# EAGLE schematic obd25k80 (EAGLE 9.6.2)
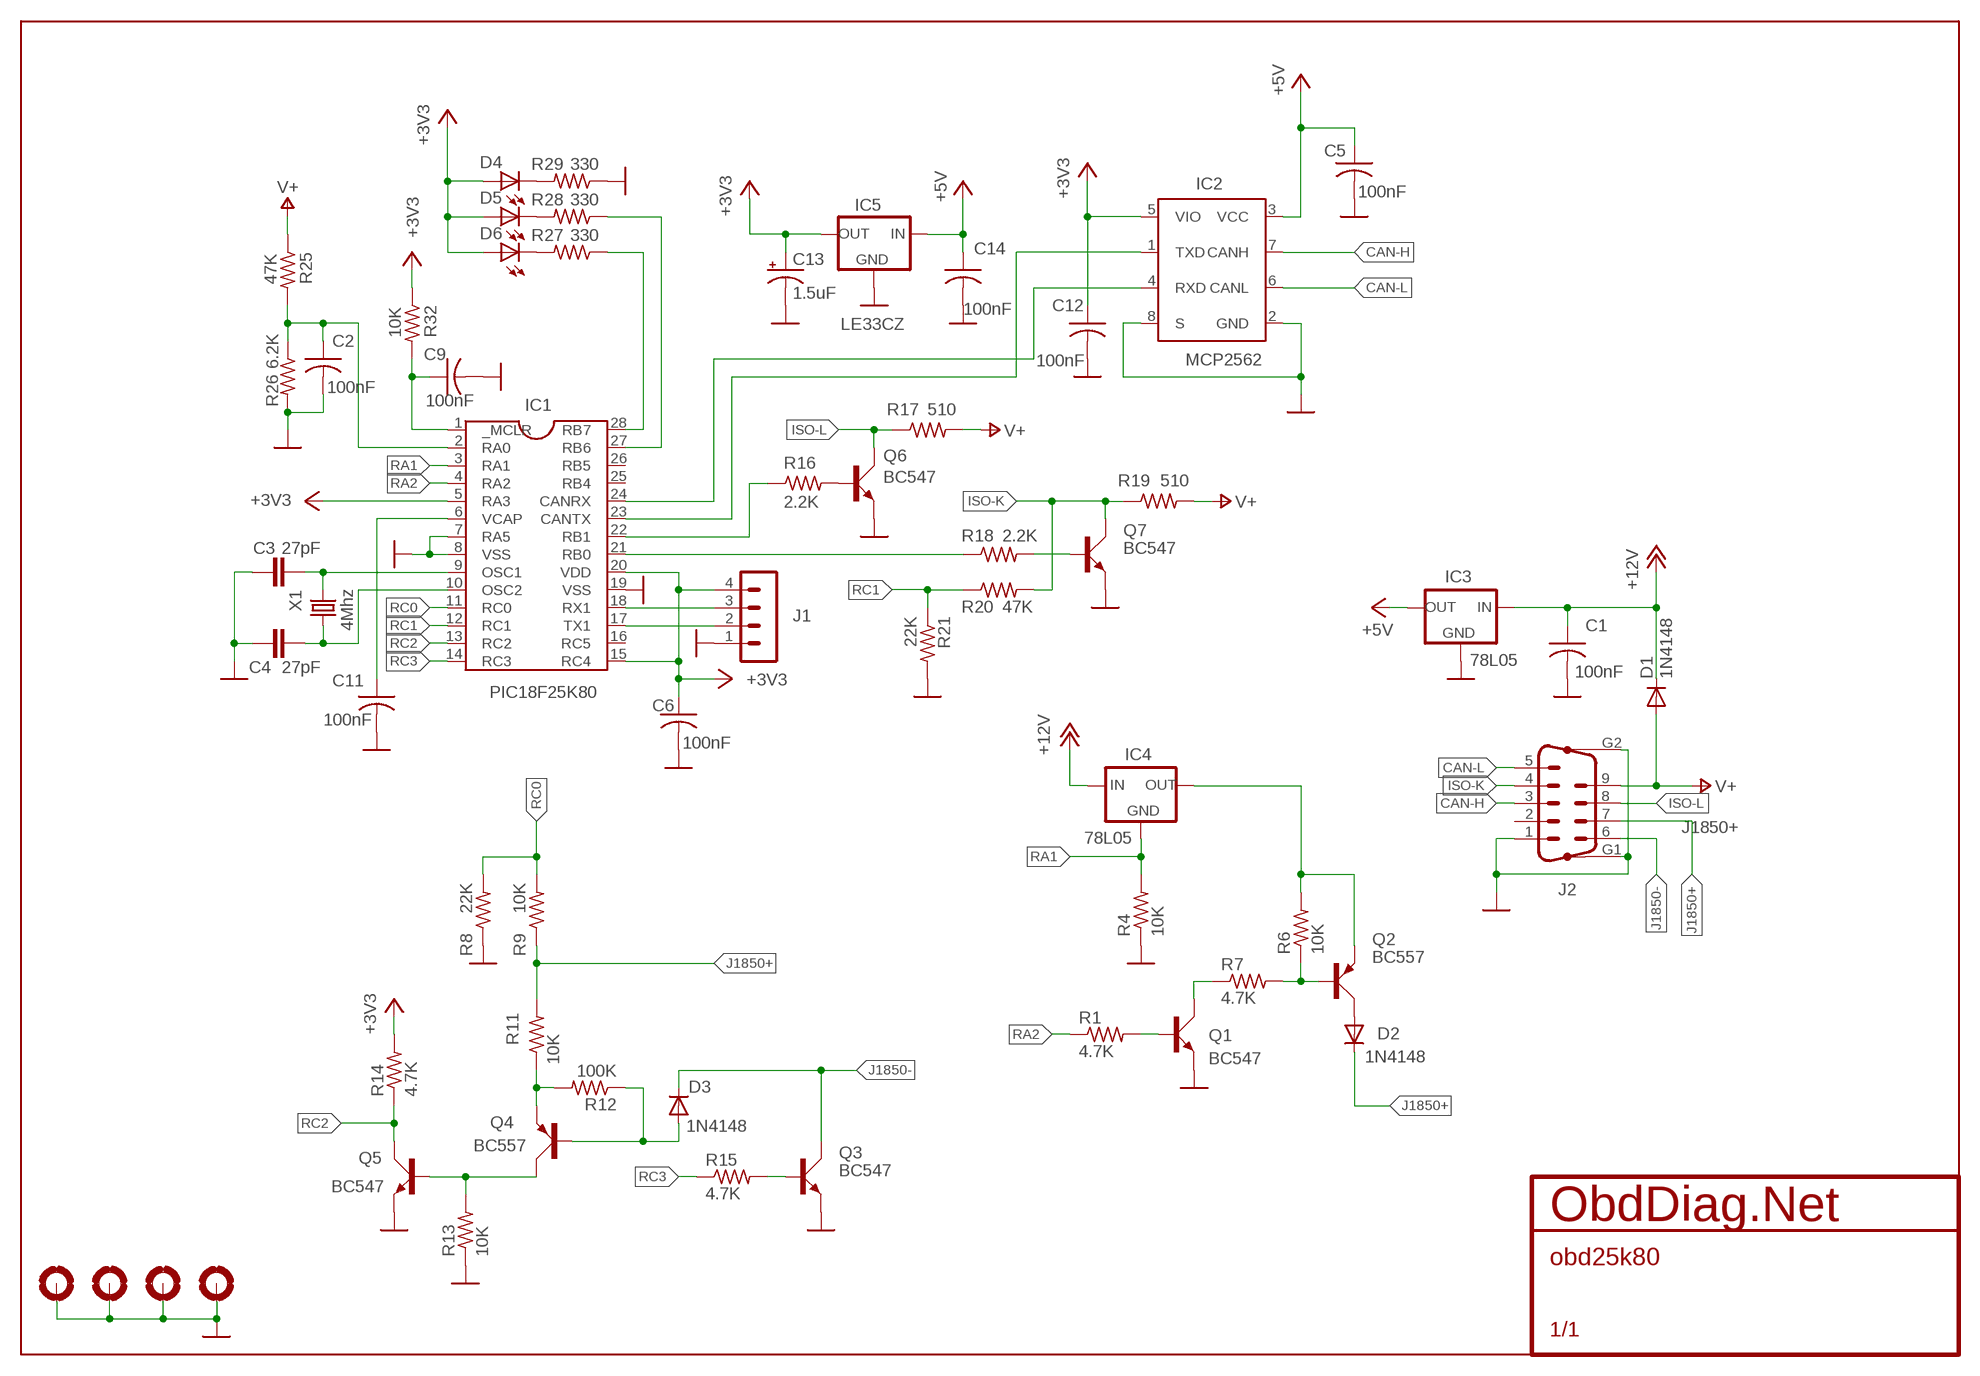
[diagram p0: schematic, sheet 1]

## Parts
C1  100nF  C-US050-025X075  [C050-025X075]
C2  100nF  C-US050-025X075  [C050-025X075]
C3  27pF  C2.5/2  [C2.5-2]
C4  27pF  C2.5/2  [C2.5-2]
C5  100nF  C-US050-025X075  [C050-025X075]
C6  100nF  C-US050-025X075  [C050-025X075]
C9  100nF  C-US050-025X075  [C050-025X075]
C11  100nF  C-US050-025X075  [C050-025X075]
C12  100nF  C-US050-025X075  [C050-025X075]
C13  1.5uF  CPOL-USE2.5-5  [E2,5-5]
C14  100nF  C-US050-025X075  [C050-025X075]
D1  1N4148  1N4148M  [D035-10M]
D2  1N4148  1N4148M  [D035-10M]
D3  1N4148  1N4148M  [D035-10M]
D4  LED5MM  [LED5MM]
D5  LED5MM  [LED5MM]
D6  LED5MM  [LED5MM]
H1  MOUNT-PAD-ROUND2.8  [2,8-PAD]
H2  MOUNT-PAD-ROUND2.8  [2,8-PAD]
H3  MOUNT-PAD-ROUND2.8  [2,8-PAD]
H4  MOUNT-PAD-ROUND2.8  [2,8-PAD]
IC1  PIC18F25K80  [DIL28]
IC2  MCP2562  [DIL8]
IC3  78L05  78LXX  [78LXX]
IC4  78L05  78LXX  [78LXX]
IC5  LE33CZ  78LXX  [78LXX]
J1  MA04-1  [MA04-1]
J2  DB9-M  M09HP  [M09HP]
Q1  BC547  [SOT54A]
Q2  BC557  [SOT54A]
Q3  BC547  [SOT54A]
Q4  BC557  [SOT54A]
Q5  BC547  [SOT54A]
Q6  BC547  [SOT54A]
Q7  BC547  [SOT54A]
R1  4.7K  R-US_0207/10  [0207/10]
R4  10K  R-US_0207/10  [0207/10]
R6  10K  R-US_0207/10  [0207/10]
R7  4.7K  R-US_0207/10  [0207/10]
R8  22K  R-US_0207/10  [0207/10]
R9  10K  R-US_0207/10  [0207/10]
R11  10K  R-US_0207/10  [0207/10]
R12  100K  R-US_0207/10  [0207/10]
R13  10K  R-US_0207/10  [0207/10]
R14  4.7K  R-US_0207/10  [0207/10]
R15  4.7K  R-US_0207/10  [0207/10]
R16  2.2K  R-US_0207/10  [0207/10]
R17  510  R-US_0207/10  [0207/10]
R18  2.2K  R-US_0207/10  [0207/10]
R19  510  R-US_0207/10  [0207/10]
R20  47K  R-US_0207/10  [0207/10]
R21  22K  R-US_0207/10  [0207/10]
R25  47K  R-US_0207/10  [0207/10]
R26  6.2K  R-US_0207/10  [0207/10]
R27  330  R-US_0207/10  [0207/10]
R28  330  R-US_0207/10  [0207/10]
R29  330  R-US_0207/10  [0207/10]
R32  10K  R-US_0207/10  [0207/10]
X1  4Mhz  CRYTALHC49S  [HC49/S]

## Nets
+3V3: C6.1 C12.1 C13.+ D4.A D5.A D6.A IC1.5(RA3) IC1.15(RC4) IC1.20(VDD) IC2.5(VIO) IC5.OUT J1.4 R14.2 R32.1
+5V: C5.1 C14.1 IC2.3(VCC) IC3.OUT IC5.IN
+12V: C1.1 D1.C IC3.IN IC4.IN
CAN-H: IC2.7(CANH) J2.3
CAN-L: IC2.6(CANL) J2.5
GND: C1.2 C2.2 C3.1 C4.2 C5.2 C6.2 C9.2 C11.2 C12.2 C13.- C14.2 H1.B2,8(MOUNT) H2.B2,8(MOUNT) H3.B2,8(MOUNT) H4.B2,8(MOUNT) IC1.7(RA5) IC1.8(VSS) IC1.19(VSS) IC2.2(GND) IC2.8(S) IC3.GND IC5.GND J1.1 J2.1 J2.G1 J2.G2 Q1.E Q3.E Q5.E Q6.E Q7.E R4.1 R8.1 R13.1 R21.2 R26.2 R29.1
ISO-K: J2.4 Q7.C R19.1 R20.2
ISO-L: J2.8 Q6.C R17.1
J1850+: D2.C J2.7 R9.1 R11.2
J1850-: D3.C J2.6 Q3.C
N$1: D4.K(C) R29.2
N$2: IC1.28(RB7) R27.1
N$6: D5.K(C) R28.2
N$7: C9.1 IC1.1(_MCLR) R32.2
N$9: IC1.22(RB1) R16.1
N$10: D6.K(C) R27.2
N$11: IC1.27(RB6) R28.1
N$14: C11.1 IC1.6(VCAP)
N$15: Q6.B R16.2
N$16: IC1.18(RX1) J1.3
N$17: IC1.24(CANRX) IC2.4(RXD)
N$18: IC1.17(TX1) J1.2
N$20: IC1.21(RB0) R18.1
N$21: C3.2 IC1.9(OSC1) X1.2
N$22: Q3.B R15.2
N$23: IC1.23(CANTX) IC2.1(TXD)
N$24: Q7.B R18.2
N$25: Q1.C R7.1
N$26: C2.1 IC1.2(RA0) R25.2 R26.1
N$28: Q1.B R1.2
N$30: Q2.B R6.1 R7.2
N$31: IC4.OUT Q2.E R6.2
N$32: D2.A Q2.C
N$37: Q4.E R11.1 R12.2
N$38: D3.A Q4.B R12.1
N$39: Q4.C Q5.B R13.2
N$41: C4.1 IC1.10(OSC2) X1.1
RA1: IC1.3(RA1) IC4.GND R4.2
RA2: IC1.4(RA2) R1.1
RC0: IC1.11(RC0) R8.2 R9.2
RC1: IC1.12(RC1) R20.1 R21.1
RC2: IC1.13(RC2) Q5.C R14.1
RC3: IC1.14(RC3) R15.1
V+: D1.A J2.9 R17.2 R19.2 R25.1
Unconnected: IC1.16(RC5) IC1.25(RB4) IC1.26(RB5) J2.2

## Library data of the parts
C1 C2 C5 C6 C9 C11 C12 C14 = rcl:C-US: CAPACITOR, American symbol; SPICEPREFIX: C
C3 C4 = capacitor-wima:C: CAPACITOR naming: grid - package width
C13 = rcl:CPOL-US: POLARIZED CAPACITOR, American symbol
D1-D3 = diode:1N4148: DIODE high speed (Philips)
D4-D6 = led:LED: LED OSRAM: - CHIPLED LG R971, LG N971, LY N971, LG Q971, LY Q971, LO R971, LY R971 LH N974, LH R974 LS Q976, LO Q976, LY Q976 LO Q996 - Hyper CHIPLED LW Q18S LB Q993, LB Q99A, LB R99A - SideLED LS A670, LO A670, LY A670, LG A670, LP A670 LB A673, LV A673, LT A673, LW A673 LH A674 LY A675 LS A676, LA A676, LO A676, LY A676, LW A676 LS A679, LY A679, LG A679 - Hyper Micro SIDELED® LS Y876, LA Y876, LO Y876, LY Y876 LT Y87S - SmartLED LW L88C, LW L88S LB L89C, LB L89S, LG L890 LS L89K, LO L89K, LY L89K LS L896, LA L896, LO L896, LY L896 - TOPLED LS T670, LO T670, LY T670, LG T670, LP T670 LSG T670, LSP T670, LSY T670, LOP T670, LYG T670 LG T671, LOG T671, LSG T671 LB T673, LV T673, LT T673, LW T673 LH T674 LS T676, LA T676, LO T676, LY T676, LB T676, LH T676, LSB T676, LW T676 LB T67C, LV T67C, LT T67C, LS T67K, LO T67K, LY T67K, LW E67C LS E67B, LA E67B, LO E67B, LY E67B, LB E67C, LV E67C, LT E67C LW T67C LS T679, LY T679, LG T679 LS T770, LO T770, LY T770, LG T770, LP T770 LB T773, LV T773, LT T773, LW T773 LH T774 LS E675, LA E675, LY E675, LS T675 LS T776, LA T776, LO T776, LY T776, LB T776 LHGB T686 LT T68C, LB T68C - Hyper Mini TOPLED® LB M676 - Mini TOPLED Santana® LG M470 LS M47K, LO M47K, LY M47K Source: http://www.osram.convergy.de LUXEON: - LUMILED® LXK2-PW12-R00, LXK2-PW12-S00, LXK2-PW14-U00, LXK2-PW14-V00 LXK2-PM12-R00, LXK2-PM12-S00, LXK2-PM14-U00 LXK2-PE12-Q00, LXK2-PE12-R00, LXK2-PE12-S00, LXK2-PE14-T00, LXK2-PE14-U00 LXK2-PB12-K00, LXK2-PB12-L00, LXK2-PB12-M00, LXK2-PB14-N00, LXK2-PB14-P00, LXK2-PB14-Q00 LXK2-PR12-L00, LXK2-PR12-M00, LXK2-PR14-Q00, LXK2-PR14-R00 LXK2-PD12-Q00, LXK2-PD12-R00, LXK2-PD12-S00 LXK2-PH12-R00, LXK2-PH12-S00 LXK2-PL12-P00, LXK2-PL12-Q00, LXK2-PL12-R00 Source: www.luxeon.com KINGBRIGHT: KA-3528ASYC Source: www.kingbright.com
H1-H4 = holes:MOUNT-PAD-ROUND: MOUNTING PAD, round
IC1 = pic18f2455:PIC18F25K80
IC2 = obddiag-net:MCP2562
IC3-IC5 = v-reg:78LXX: VOLTAGE REGULATOR
J1 = obddiag-net:MA04-1
J2 = con-subd:M09HP: SUB-D
Q1 Q3 Q5-Q7 = transistor-small-signal:BC547: NPN TRANSISTOR
Q2 Q4 = transistor-small-signal:BC557: PNP TRANSISTOR
R1 R4 R6-R9 R11-R21 R25-R29 R32 = rcl:R-US_: RESISTOR, American symbol
X1 = crystal:CRYTAL: CRYSTAL